# EAGLE design main_full (EAGLE 9.4.1)
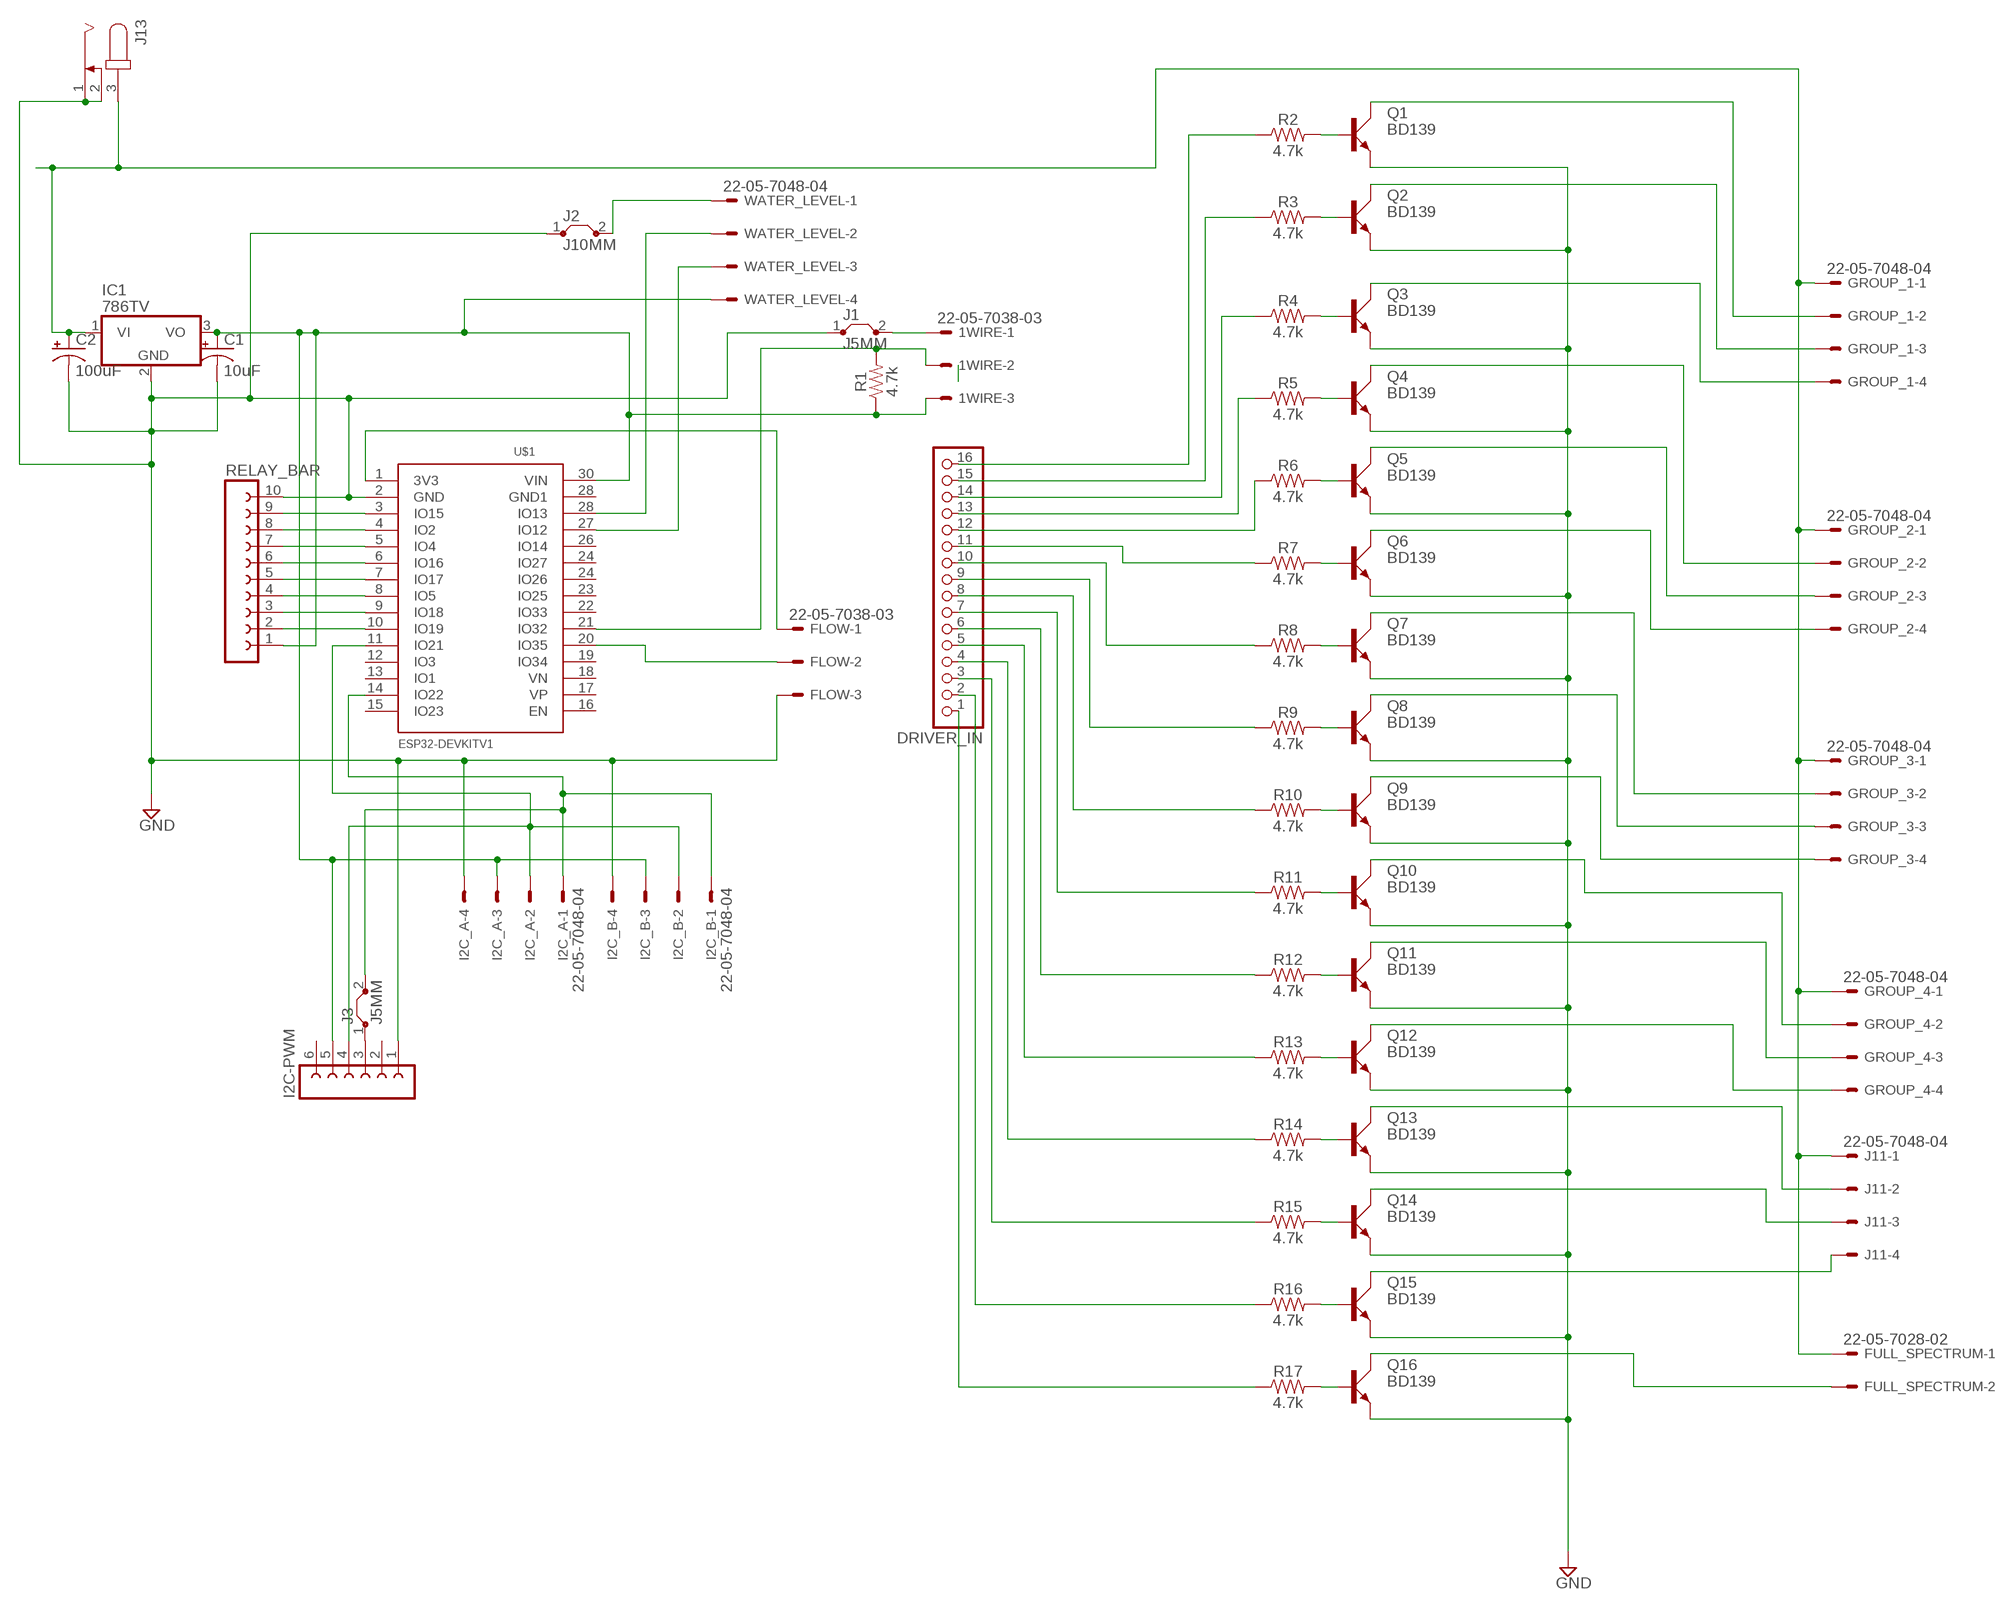
[diagram p0: schematic, sheet 1]

## Parts
1WIRE  22-05-7038-03  [7395-03]
C1  10uF  10UF-POLAR-RADIAL-2.5MM-25V-20%  [CPOL-RADIAL-2.5MM-5MM]
C2  100uF  100UF-POLAR-RADIAL-2.5MM-25V-20%  [CPOL-RADIAL-2.5MM-6.5MM]
DRIVER_IN  PINHD-1X16/90  [1X16/90]
FLOW  22-05-7038-03  [7395-03]
FULL_SPECTRUM  22-05-7028-02  [7395-02]
GROUP_1  22-05-7048-04  [7395-04]
GROUP_2  22-05-7048-04  [7395-04]
GROUP_3  22-05-7048-04  [7395-04]
GROUP_4  22-05-7048-04  [7395-04]
I2C-PWM  FE06W  [FE06W]
I2C_A  22-05-7048-04  [7395-04]
I2C_B  22-05-7048-04  [7395-04]
IC1  786TV  [TO220V]
J1  J5MM  [05]
J2  J10MM  [10]
J3  J5MM  [05]
J11  22-05-7048-04  [7395-04]
J13  JACK-PLUG0  [SPC4077]
Q1  BD139  [TO126AV]
Q2  BD139  [TO126AV]
Q3  BD139  [TO126AV]
Q4  BD139  [TO126AV]
Q5  BD139  [TO126AV]
Q6  BD139  [TO126AV]
Q7  BD139  [TO126AV]
Q8  BD139  [TO126AV]
Q9  BD139  [TO126AV]
Q10  BD139  [TO126AV]
Q11  BD139  [TO126AV]
Q12  BD139  [TO126AV]
Q13  BD139  [TO126AV]
Q14  BD139  [TO126AV]
Q15  BD139  [TO126AV]
Q16  BD139  [TO126AV]
R1  4.7k  4.7KOHM-0603-1/10W-1%  [0603]
R2  4.7k  4.7KOHM-0603-1/10W-1%  [0603]
R3  4.7k  4.7KOHM-0603-1/10W-1%  [0603]
R4  4.7k  4.7KOHM-0603-1/10W-1%  [0603]
R5  4.7k  4.7KOHM-0603-1/10W-1%  [0603]
R6  4.7k  4.7KOHM-0603-1/10W-1%  [0603]
R7  4.7k  4.7KOHM-0603-1/10W-1%  [0603]
R8  4.7k  4.7KOHM-0603-1/10W-1%  [0603]
R9  4.7k  4.7KOHM-0603-1/10W-1%  [0603]
R10  4.7k  4.7KOHM-0603-1/10W-1%  [0603]
R11  4.7k  4.7KOHM-0603-1/10W-1%  [0603]
R12  4.7k  4.7KOHM-0603-1/10W-1%  [0603]
R13  4.7k  4.7KOHM-0603-1/10W-1%  [0603]
R14  4.7k  4.7KOHM-0603-1/10W-1%  [0603]
R15  4.7k  4.7KOHM-0603-1/10W-1%  [0603]
R16  4.7k  4.7KOHM-0603-1/10W-1%  [0603]
R17  4.7k  4.7KOHM-0603-1/10W-1%  [0603]
RELAY_BAR  FE10W  [FE10W]
U$1  ESP32DEVKITV1  [ESP32-DEVKITV1]
WATER_LEVEL  22-05-7048-04  [7395-04]

## Nets
GND: C1.2(-) C2.2(-) FLOW.3 I2C-PWM.1 I2C_A.4 I2C_B.4 IC1.2(GND) J1.1 J2.1 J13.1 J13.2 Q1.E Q2.E Q3.E Q4.E Q5.E Q6.E Q7.E Q8.E Q9.E Q10.E Q11.E Q12.E Q13.E Q14.E Q15.E Q16.E RELAY_BAR.10 U$1.2(GND)
N$1: C2.1(+) FULL_SPECTRUM.1 GROUP_1.1 GROUP_2.1 GROUP_3.1 GROUP_4.1 IC1.1(VI) J11.1 J13.3
N$2: 1WIRE.2 R1.2 U$1.21(IO32)
N$3: Q1.B R2.2
N$4: Q2.B R3.2
N$5: Q3.B R4.2
N$6: Q4.B R5.2
N$7: Q5.B R6.2
N$8: Q6.B R7.2
N$9: Q7.B R8.2
N$10: Q8.B R9.2
N$11: Q9.B R10.2
N$12: Q10.B R11.2
N$13: Q11.B R12.2
N$14: Q12.B R13.2
N$15: Q13.B R14.2
N$16: Q14.B R15.2
N$17: Q15.B R16.2
N$18: Q16.B R17.2
N$19: DRIVER_IN.1 R17.1
N$20: DRIVER_IN.2 R16.1
N$21: DRIVER_IN.3 R15.1
N$22: DRIVER_IN.4 R14.1
N$23: DRIVER_IN.5 R13.1
N$24: DRIVER_IN.6 R12.1
N$25: DRIVER_IN.7 R11.1
N$26: DRIVER_IN.8 R10.1
N$27: DRIVER_IN.9 R9.1
N$28: DRIVER_IN.10 R8.1
N$29: DRIVER_IN.11 R7.1
N$30: DRIVER_IN.12 R6.1
N$31: DRIVER_IN.13 R5.1
N$32: DRIVER_IN.14 R4.1
N$33: DRIVER_IN.15 R3.1
N$34: DRIVER_IN.16 R2.1
N$35: RELAY_BAR.9 U$1.3(IO15)
N$36: RELAY_BAR.8 U$1.4(IO2)
N$37: RELAY_BAR.7 U$1.5(IO4)
N$38: RELAY_BAR.6 U$1.6(IO16)
N$39: RELAY_BAR.5 U$1.7(IO17)
N$40: RELAY_BAR.4 U$1.8(IO5)
N$41: RELAY_BAR.3 U$1.9(IO18)
N$42: RELAY_BAR.2 U$1.10(IO19)
N$43: 1WIRE.3 C1.1(+) I2C-PWM.5 I2C_A.3 I2C_B.3 IC1.3(VO) R1.1 RELAY_BAR.1 U$1.30(VIN) WATER_LEVEL.4
N$44: U$1.28(IO13) WATER_LEVEL.2
N$45: U$1.27(IO12) WATER_LEVEL.3
N$47: FLOW.2 U$1.20(IO35)
N$48: FLOW.1 U$1.1(3V3)
N$49: I2C-PWM.4 I2C_A.2 I2C_B.2 U$1.11(IO21)
N$50: I2C_A.1 I2C_B.1 J3.2 U$1.14(IO22)
N$51: GROUP_1.2 Q1.C
N$52: GROUP_1.3 Q2.C
N$53: GROUP_1.4 Q3.C
N$54: GROUP_2.2 Q4.C
N$55: GROUP_2.3 Q5.C
N$56: GROUP_2.4 Q6.C
N$57: GROUP_3.2 Q7.C
N$58: GROUP_3.3 Q8.C
N$59: GROUP_3.4 Q9.C
N$60: GROUP_4.2 Q10.C
N$61: GROUP_4.3 Q11.C
N$62: GROUP_4.4 Q12.C
N$63: 1WIRE.1 J1.2
N$64: J11.2 Q13.C
N$65: J11.3 Q14.C
N$66: J11.4 Q15.C
N$67: FULL_SPECTRUM.2 Q16.C
N$68: J2.2 WATER_LEVEL.1
N$69: I2C-PWM.3 J3.1
Unconnected: I2C-PWM.2 I2C-PWM.6 U$1.12(IO3) U$1.13(IO1) U$1.15(IO23) U$1.16(EN) U$1.17(VP) U$1.18(VN) U$1.19(IO34) U$1.22(IO33) U$1.23(IO25) U$1.24(IO26) U$1.24(IO27) U$1.26(IO14) U$1.28(GND1)

## Library data of the parts
1WIRE FLOW = con-molex:22-?-03: CONNECTOR wire to board 2.54 mm (.1 inch) pitch header; MF: MOLEX; OC_FARNELL: unknown; OC_NEWARK: unknown
C1 = SparkFun-Capacitors:10UF-POLAR: 10.0µF polarized capacitors A capacitor is a passive two-terminal electrical component used to store electrical energy temporarily in an electric field.; PROD_ID: CAP-08440
C2 = SparkFun-Capacitors:100UF-POLAR: 100µF polarized capacitors A capacitor is a passive two-terminal electrical component used to store electrical energy temporarily in an electric field.; PROD_ID: CAP-08439
DRIVER_IN = pinhead:PINHD-1X16: PIN HEADER
FULL_SPECTRUM = con-molex:22-?-02: CONNECTOR wire to board 2.54 mm (.1 inch) pitch header; MF: MOLEX; OC_FARNELL: 9731601; OC_NEWARK: unknown
GROUP_1-GROUP_4 I2C_A I2C_B J11 WATER_LEVEL = con-molex:22-?-04: CONNECTOR wire to board 2.54 mm (.1 inch) pitch header; MF: MOLEX; OC_FARNELL: unknown; OC_NEWARK: unknown
I2C-PWM = con-lsta:FE06W: FEMALE HEADER; OC_FARNELL: unknown; OC_NEWARK: unknown
IC1 = linear:78*: Positive VOLTAGE REGULATOR Source: http://cache.national.com/ds/LM/LM78L05.pdf http://www.fairchildsemi.com/ds/LM/LM7805.pdf
J1-J3 = jumper:J: Bridge
J13 = con-jack:JACK-PLUG: DC POWER JACK Power Jack, DC, Right Angle, Through Hole, Rated 5A at 16VDC, PC Terminals Distributor: Farnell (www.Farnell.de) Drawing: 84N1161.pdf / 84N1162.pdf Manufacturer: SPC Technology (www.spctechnology.com) Type: SPC4077 / SPC 4078; OC_FARNELL: unknown; OC_NEWARK: unknown
Q1-Q16 = transistor-power:BD139: NPN TRANSISTOR
R1-R17 = SparkFun-Resistors:4.7KOHM: 4.7kΩ resistor A resistor is a passive two-terminal electrical component that implements electrical resistance as a circuit element. Resistors act to reduce current flow, and, at the same time, act to lower voltage levels within circuits. - Wikipedia; PROD_ID: RES-07857
RELAY_BAR = con-lsta:FE10W: FEMALE HEADER; OC_FARNELL: unknown; OC_NEWARK: unknown
U$1 = ESP32-DEVKITV1:ESP32DEVKITV1

## Board
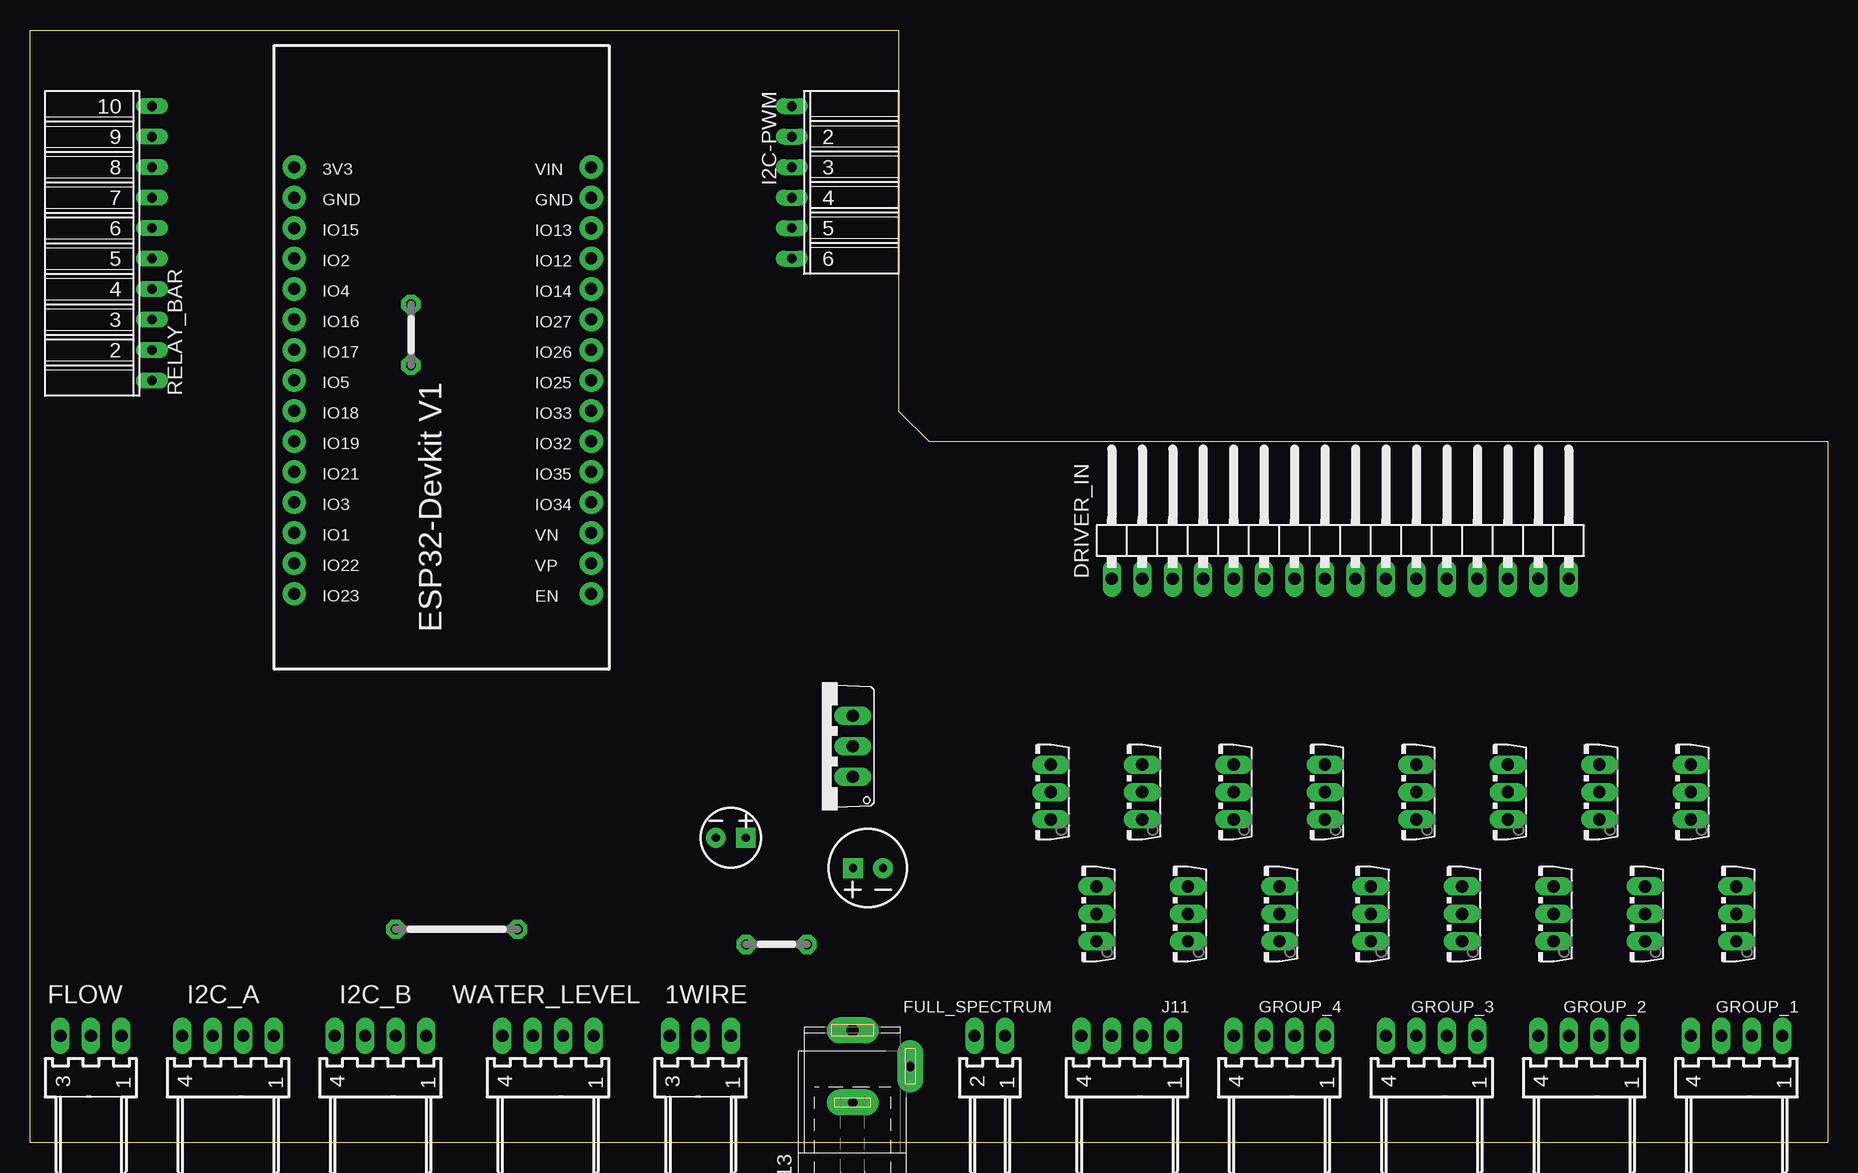
[diagram p1: board, top side]
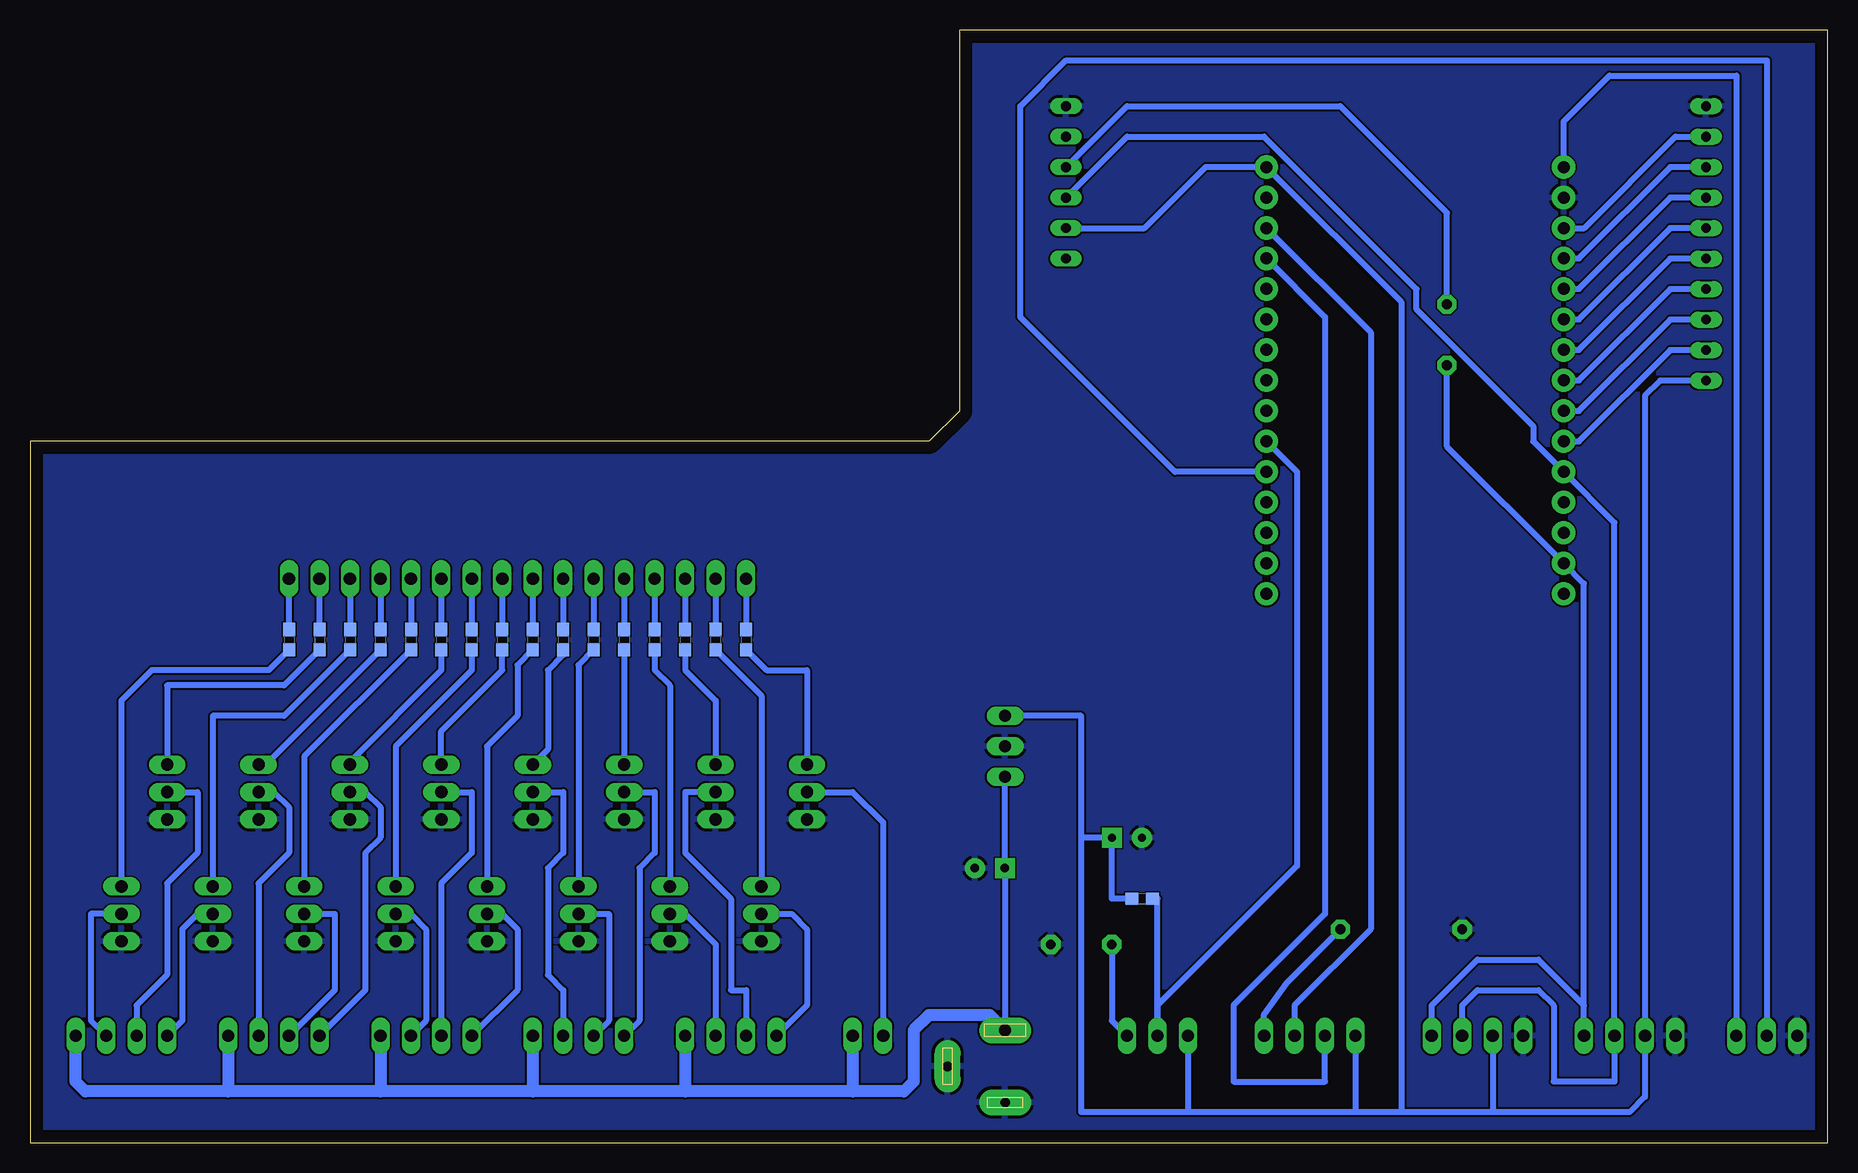
[diagram p2: board, bottom side, seen from below]

Size 149.86 x 92.71 mm. Coordinates in mm from the lower left corner, seen from the top.
Outline: 0,92.71 72.39,92.71 72.39,60.96 74.93,58.42 149.86,58.42 149.86,0 0,0 0,92.71
Copper layers (1*16): Top 0.035mm / dielectric 1.5mm / Bottom 0.035mm
Design rules "default": minimum track width 6mil, minimum drill 0.35mm, track to track 6mil, track to pad 6mil, pad to pad 6mil, via to via 6mil, smd to smd 6mil, copper to edge 40mil, drill to drill 6mil, minimum pad ring 10mil, minimum via ring 8mil, stop-mask expansion 4mil, vias tented up to drill 0mil, thermal gap 10mil

### Footprints (pad centres in the part's own frame; a part is rotated, then mirrored left to right if it is on the bottom)
7395-03 = drill 1.016 long: 1 2.54,0; 2 0,0; 3 -2.54,0
CPOL-RADIAL-2.5MM-5MM = drill 0.7 pad 1.651 square: 1 1.25,0 | drill 0.7 pad 1.651: 2 -1.25,0
CPOL-RADIAL-2.5MM-6.5MM = drill 0.7 pad 1.651 square: 1 1.25,0 | drill 0.7 pad 1.651: 2 -1.25,0
1X16/90 = drill 1.016 long: 1 -19.05,-3.81; 2 -16.51,-3.81; 3 -13.97,-3.81; 4 -11.43,-3.81; 5 -8.89,-3.81; 6 -6.35,-3.81; 7 -3.81,-3.81; 8 -1.27,-3.81; 9 1.27,-3.81; 10 3.81,-3.81; 11 6.35,-3.81; 12 8.89,-3.81; 13 11.43,-3.81; 14 13.97,-3.81; 15 16.51,-3.81; 16 19.05,-3.81
7395-02 = drill 1.016 long: 1 1.27,0; 2 -1.27,0
7395-04 = drill 1.016 long: 1 3.81,0; 2 1.27,0; 3 -1.27,0; 4 -3.81,0
FE06W = drill 0.813 long: 1 -6.35,0; 2 -3.81,0; 3 -1.27,0; 4 1.27,0; 5 3.81,0; 6 6.35,0
TO220V = drill 1.016 long: 1 -2.54,-2.54; 2 0,-2.54; 3 2.54,-2.54
05 = drill 0.813 pad 1.6 octagon: 1 -2.54,0; 2 2.54,0
10 = drill 0.813 pad 1.6 octagon: 1 -5.08,0; 2 5.08,0
SPC4077 = drill 0.8 pad 2.184 long: 1 -3,0; 2 0,-4.8 | drill 1 pad 2.184 long: 3 3,0
TO126AV = drill 1.016 long: B 2.286,-1.27; C 0,-1.27; E -2.286,-1.27
0603 = smd 1.1 x 1: 1 -0.85,0; 2 0.85,0
FE10W = drill 0.813 long: 1 -11.43,0; 2 -8.89,0; 3 -6.35,0; 4 -3.81,0; 5 -1.27,0; 6 1.27,0; 7 3.81,0; 8 6.35,0; 9 8.89,0; 10 11.43,0
ESP32-DEVKITV1 = drill 1 pad 1.93: 1 -22.87,-13.54; 2 -20.33,-13.54; 3 -17.79,-13.54; 4 -15.25,-13.54; 5 -12.71,-13.54; 6 -10.17,-13.54; 7 -7.63,-13.54; 8 -5.09,-13.54; 9 -2.55,-13.54; 10 -0.01,-13.54; 11 2.53,-13.54; 12 5.07,-13.54; 13 7.61,-13.54; 14 10.15,-13.54; 15 12.69,-13.54; 16 12.69,11.23; 17 10.15,11.23; 18 7.61,11.23; 19 5.07,11.23; 20 2.53,11.23; 21 -0.01,11.23; 22 -2.55,11.23; 23 -5.09,11.23; 24 -7.63,11.23; 25 -10.17,11.23; 26 -12.71,11.23; 27 -15.25,11.23; 28 -17.79,11.23; 29 -20.33,11.23; 30 -22.87,11.23

### Placement (x,y rotation side)
1WIRE  55.88,8.89 0 top
C1  58.42,25.4 0 top
C2  69.85,22.86 180 top
DRIVER_IN  109.22,50.8 0 top
FLOW  5.08,8.89 0 top
FULL_SPECTRUM  80.01,8.89 0 top
GROUP_1  142.24,8.89 0 top
GROUP_2  129.54,8.89 0 top
GROUP_3  116.84,8.89 0 top
GROUP_4  104.14,8.89 0 top
I2C-PWM  63.5,80.01 270 top
I2C_A  16.51,8.89 0 top
I2C_B  29.21,8.89 0 top
IC1  66.04,33.02 90 top
J1  62.23,16.51 180 top
J2  35.56,17.78 0 top
J3  31.75,67.31 270 top
J11  91.44,8.89 0 top
J13  68.58,6.35 90 top
Q1  140.97,19.05 90 top
Q2  137.16,29.21 90 top
Q3  133.35,19.05 90 top
Q4  129.54,29.21 90 top
Q5  125.73,19.05 90 top
Q6  121.92,29.21 90 top
Q7  118.11,19.05 90 top
Q8  114.3,29.21 90 top
Q9  110.49,19.05 90 top
Q10  106.68,29.21 90 top
Q11  102.87,19.05 90 top
Q12  99.06,29.21 90 top
Q13  95.25,19.05 90 top
Q14  91.44,29.21 90 top
Q15  87.63,19.05 90 top
Q16  83.82,29.21 90 top
R1  57.15,20.32 0 bottom
R2  128.27,41.91 270 bottom
R3  125.73,41.91 270 bottom
R4  123.19,41.91 270 bottom
R5  120.65,41.91 270 bottom
R6  118.11,41.91 270 bottom
R7  115.57,41.91 270 bottom
R8  113.03,41.91 270 bottom
R9  110.49,41.91 270 bottom
R10  107.95,41.91 270 bottom
R11  105.41,41.91 270 bottom
R12  102.87,41.91 270 bottom
R13  100.33,41.91 270 bottom
R14  97.79,41.91 270 bottom
R15  95.25,41.91 270 bottom
R16  92.71,41.91 270 bottom
R17  90.17,41.91 270 bottom
RELAY_BAR  10.16,74.93 90 top
U$1  35.56,58.42 270 top
WATER_LEVEL  43.18,8.89 0 top

### Tracks (layer width: path | path; a pad name or v marks a point on that pad's centre or on a via)
GND
  pour Bottom: 0,92.71 72.39,92.71 72.39,60.96 74.93,58.42 149.86,58.42 149.86,0 0,0
N$1
  Bottom 0.508: IC1.1 68.58,22.86 C2.1 68.6,9.37 J13.3
  Bottom 1.016: J13.3 69.85,10.62 74.93,10.62 76.2,9.35 76.2,5.08 77.01,4.27 81.28,4.27 | 81.28,4.27 95.25,4.27 | 95.25,4.27 107.95,4.27 | 107.95,4.27 120.65,4.27 | 120.65,4.27 133.35,4.27 | 133.35,4.27 145.24,4.27 146.05,5.08 GROUP_1.1 | GROUP_2.1 133.35,4.27 | GROUP_3.1 120.65,4.27 | GROUP_4.1 107.95,4.27 | J11.1 95.25,4.27 | FULL_SPECTRUM.1 81.28,4.27
N$2
  Bottom 0.508: U$1.21 44.25,55.89 44.25,23.06 55.88,11.43 1WIRE.2 55.88,20.32 R1.2
N$3
  Bottom 0.508: R2.2 129.96,39.37 139.7,39.37 142.24,36.83 Q1.B
N$4
  Bottom 0.508: R3.2 128.69,38.1 138.43,38.1 Q2.B
N$5
  Bottom 0.508: R4.2 128.69,35.56 134.62,35.56 Q3.B
N$6
  Bottom 0.508: R5.2 130.21,31.5 Q4.B
N$7
  Bottom 0.508: R6.2 127,32.17 Q5.B
N$8
  Bottom 0.508: Q6.B 123.19,31.75 115.57,39.37 R7.2
N$9
  Bottom 0.508: R8.2 113.03,39.37 119.38,33.02 Q7.B
N$10
  Bottom 0.508: Q8.B 115.57,34.29 110.49,39.37 R9.2
N$11
  Bottom 0.508: R10.2 109.22,39.79 109.22,35.56 111.76,33.02 Q9.B
N$12
  Bottom 0.508: R11.2 105.41,40.64 106.68,39.37 106.68,32.77 Q10.B
N$13
  Bottom 0.508: R12.2 104.14,39.79 Q11.B
N$14
  Bottom 0.508: R13.2 Q12.B
N$15
  Bottom 0.508: R14.2 97.79,39.37 96.52,38.1 Q13.B
N$16
  Bottom 0.508: R15.2 95.25,39.37 92.71,36.83 Q14.B
N$17
  Bottom 0.508: R16.2 88.9,37.25 Q15.B
N$18
  Bottom 0.508: R17.2 88.48,39.37 85.09,39.37 Q16.B
N$19
  Bottom 0.508: DRIVER_IN.1 R17.1
N$20
  Bottom 0.508: DRIVER_IN.2 R16.1
N$21
  Bottom 0.508: DRIVER_IN.3 R15.1
N$22
  Bottom 0.508: DRIVER_IN.4 R14.1
N$23
  Bottom 0.508: DRIVER_IN.5 R13.1
N$24
  Bottom 0.508: DRIVER_IN.6 R12.1
N$25
  Bottom 0.508: DRIVER_IN.7 R11.1
N$26
  Bottom 0.508: DRIVER_IN.8 R10.1
N$27
  Bottom 0.508: DRIVER_IN.9 R9.1
N$28
  Bottom 0.508: DRIVER_IN.10 R8.1
N$29
  Bottom 0.508: DRIVER_IN.11 R7.1
N$30
  Bottom 0.508: DRIVER_IN.12 R6.1
N$31
  Bottom 0.508: DRIVER_IN.13 R5.1
N$32
  Bottom 0.508: DRIVER_IN.14 R4.1
N$33
  Bottom 0.508: R3.1 DRIVER_IN.15
N$34
  Bottom 0.508: R2.1 DRIVER_IN.16
N$35
  Bottom 0.508: U$1.3 20.31,76.21 12.7,83.82 RELAY_BAR.9
N$36
  Bottom 0.508: U$1.4 20.75,73.67 13.14,81.28 RELAY_BAR.8
N$37
  Bottom 0.508: RELAY_BAR.7 13.14,78.74 20.75,71.13 U$1.5
N$38
  Bottom 0.508: U$1.6 20.75,68.59 13.14,76.2 RELAY_BAR.6
N$39
  Bottom 0.508: RELAY_BAR.5 13.14,73.66 20.75,66.05 U$1.7
N$40
  Bottom 0.508: RELAY_BAR.4 13.14,71.12 20.75,63.51 U$1.8
N$41
  Bottom 0.508: RELAY_BAR.3 13.14,68.58 20.75,60.97 U$1.9
N$42
  Bottom 0.508: U$1.10 20.75,58.43 13.14,66.04 RELAY_BAR.2
N$43
  Bottom 0.508: RELAY_BAR.1 13.97,63.5 15.24,62.23 I2C_A.3 15.24,3.81 16.51,2.54 27.94,2.54 | 27.94,2.54 35.56,2.54 | 35.56,2.54 39.37,2.54 | 39.37,2.54 53.34,2.54 | 53.34,2.54 62.23,2.54 62.23,25.4 | I2C_B.3 27.94,2.54 | WATER_LEVEL.4 39.37,2.54 | 62.23,25.4 62.23,35.56 IC1.3 | I2C-PWM.5 56.96,76.2 51.87,81.29 U$1.30 35.56,70.06 35.56,2.54 | C1.1 59.69,25.4 | 59.69,25.4 62.23,25.4 | 1WIRE.3 53.34,2.54 | R1.1 59.69,20.32 59.69,25.4
N$44
  Bottom 0.508: U$1.28 38.1,67.52 38.1,17.78 44.45,11.43 WATER_LEVEL.2
N$45
  Bottom 0.508: U$1.27 41.91,68.79 41.91,19.05 49.53,11.43 49.53,5.08 41.91,5.08 WATER_LEVEL.3
N$47
  Bottom 0.508: U$1.20 54.41,55.89 67.31,68.79 67.31,86.36 63.5,90.17 5.08,90.17 FLOW.2
N$48
  Bottom 0.508: U$1.1 22.02,85.1 18.21,88.91 7.62,88.91 FLOW.1
N$49
  Bottom 0.508: I2C-PWM.4 58.42,83.82 46.99,83.82 34.29,71.12 34.29,69.43 24.56,59.7 24.56,58.43 U$1.11 17.78,51.65 I2C_A.2 17.78,5.08 22.86,5.08 22.86,11.43 24.13,12.7 29.21,12.7 30.48,11.43 I2C_B.2
N$50
  Bottom 0.508: I2C_B.1 33.02,11.43 29.21,15.24 24.13,15.24 20.32,11.43 I2C_A.1 20.32,46.57 U$1.14 31.75,58 J3.2
N$51
  Bottom 0.508: Q1.C 144.78,19.05 144.78,10.16 GROUP_1.2
N$52
  Bottom 0.508: Q2.C 135.89,29.21 135.89,24.13 138.43,21.59 138.43,13.97 140.97,11.43 GROUP_1.3
N$53
  Bottom 0.508: Q3.C 135.89,19.05 137.16,17.78 137.16,10.16 GROUP_1.4
N$54
  Bottom 0.508: Q4.C 129.54,29.21 128.27,27.94 128.27,24.13 130.81,21.59 GROUP_2.2
N$55
  Bottom 0.508: Q5.C 124.46,19.05 124.46,12.7 GROUP_2.3
N$56
  Bottom 0.508: Q6.C 121.92,29.21 120.65,27.94 120.65,25.4 121.92,24.13 121.92,12.7 GROUP_2.4
N$57
  Bottom 0.508: Q7.C 118.11,19.05 116.84,17.78 116.84,10.16 GROUP_3.2
N$58
  Bottom 0.508: Q8.C 113.03,29.21 113.03,24.13 115.57,21.59 GROUP_3.3
N$59
  Bottom 0.508: Q9.C 110.49,19.05 109.22,17.78 109.22,12.7 GROUP_3.4
N$60
  Bottom 0.508: Q10.C 105.41,29.21 105.41,24.13 106.68,22.86 106.68,13.97 105.41,12.7 GROUP_4.2
N$61
  Bottom 0.508: GROUP_4.3 101.6,10.16 101.6,19.05 Q11.C
N$62
  Bottom 0.508: Q12.C 97.79,29.21 97.79,24.13 99.06,22.86 99.06,10.16 GROUP_4.4
N$63
  Bottom 0.508: J1.2 59.69,10.16 1WIRE.1
N$64
  Bottom 0.508: Q13.C 95.25,19.05 92.71,16.51 J11.2
N$65
  Bottom 0.508: Q14.C 95.25,29.21 95.25,24.13 91.44,20.32 91.44,12.7 90.17,12.7 J11.3
N$66
  Bottom 0.508: Q15.C 86.36,19.05 85.09,17.78 85.09,11.43 J11.4
N$67
  Bottom 0.508: Q16.C 81.28,29.21 78.74,26.67 FULL_SPECTRUM.2
N$68
  Bottom 0.508: WATER_LEVEL.1 46.99,10.67 45.09,13.33 J2.2
N$69
  Bottom 0.508: J3.1 31.75,77.47 40.64,86.36 58.42,86.36 I2C-PWM.3